# Altium schematic sheet 盟莆安方案.schdoc
size A4; Author: WJL; CompanyName: Wuxi China Resources Semico Co., Ltd.; ImagePath: F:\work group\公司信息\semico.bmp
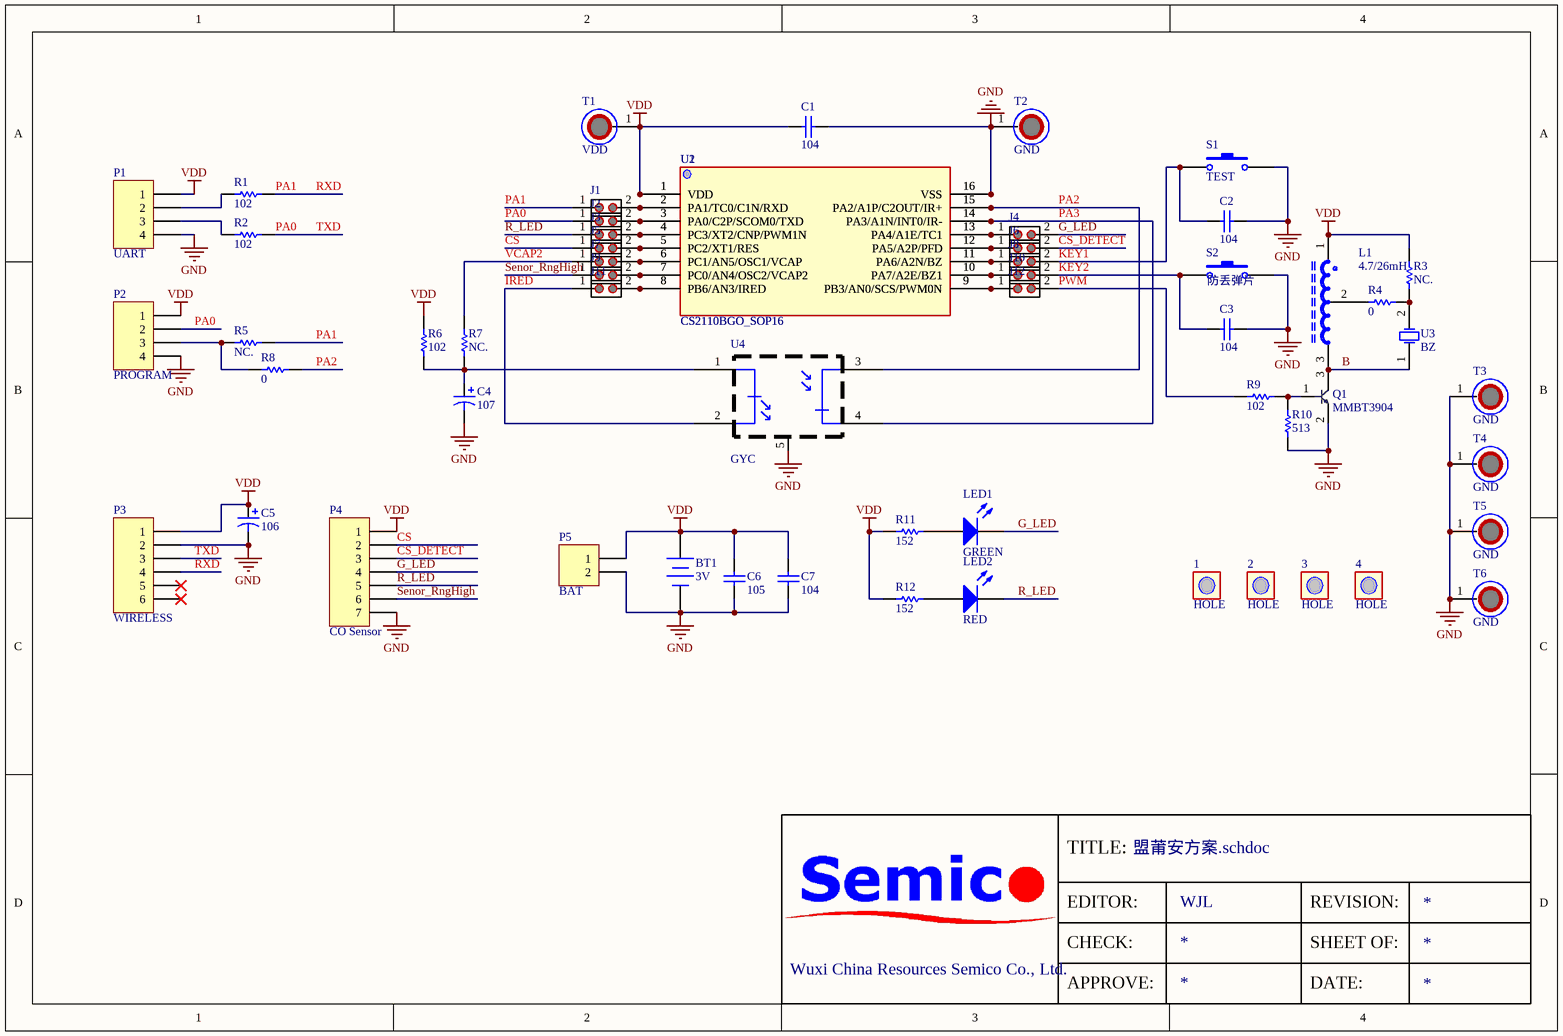
[diagram p0: 盟莆安方案.schdoc]

## Parts
1  HOLE  [HOLE]
2  HOLE  [HOLE]
3  HOLE  [HOLE]
4  HOLE  [HOLE]
BT1  3V  [BAT-2]
C1  104  [C0805]
C2  104  [C0805]
C3  104  [C0805]
C4  107  [220UF/16V]
C5  106  [47UF/25V]
C6  105  [C0805]
C7  104  [C0805]
J1  (no value)  [SIP2]
J2  (no value)  [SIP2]
J3  (no value)  [SIP2]
J4  (no value)  [SIP2]
J5  (no value)  [SIP2]
J6  (no value)  [SIP2]
J7  (no value)  [SIP2]
J8  (no value)  [SIP2]
J9  (no value)  [SIP2]
J10  (no value)  [SIP2]
J11  (no value)  [SIP2]
J12  (no value)  [SIP2]
L1  4.7/26mH  [LGB3W0912]
LED1  GREEN  [L0805]
LED2  RED  [L0805]
P1  UART  [HDR1X4]
P2  PROGRAM  [HDR1X4]
P3  WIRELESS  [HDR1X6]
P4  CO Sensor  [HDR1X7]
P5  BAT  [3.81-02P]
Q1  MMBT3904  [MMBT3906]
R1  102  [0805]
R2  102  [0805]
R3  NC.  [0805]
R4  0  [0805]
R5  NC.  [0805]
R6  102  [0805]
R7  NC.  [0805]
R8  0  [0805]
R9  102  [0805]
R10  513  [0805]
R11  152  [0805]
R12  152  [0805]
S1  TEST  [KEYP]
S2  (no value)  [KEYP]
T1  VDD  [TEST POINT]
T2  GND  [TEST POINT]
T3  GND  [TEST POINT]
T4  GND  [TEST POINT]
T5  GND  [TEST POINT]
T6  GND  [TEST POINT]
U1  CS2110BGO_SOP16  [SOP16]
U2  CS2110BGO_SOP16  [TSOP16底座]
U3  BZ  [SMD-BZ - 4]
U4  GYC  [YANCANG1]

## Nets
GND: BT1.2(-) C1.1 C2.2 C3.2 C4.2 C5.2 C6.2 C7.2 P1.4 P2.4 P3.2 P4.7 P5.2 Q1.2(E) R10.1 S1.2 S2.2 T2.1 T3.1 T4.1 T5.1 T6.1 U1.16(VSS) U2.16(VSS) U4.5(GND)
VDD: BT1.1(+) C1.2 C5.1 C6.1 C7.1 L1.1 P1.1 P2.1 P3.1 P4.1 P5.1 R3.1 R6.1 R11.2 R12.2 T1.1 U1.1(VDD) U2.1(VDD)
B: L1.3 Q1.3(C) U3.1(OSC1)
CS: J5.1 P4.2
CS_DETECT: J6.2 P4.3
G_LED: J4.2 LED1.2(K) P4.4
IRED: J11.1 U4.2
KEY1: C2.1 J8.2 S1.1
KEY2: C3.1 J10.2 S2.1
PA0: J2.1 P2.2 P3.3 R2.1  [also labelled TXD]
PA1: J1.1 P3.4 R1.1 R5.1  [also labelled RXD]
PA2: R8.1 U1.15(PA2/A1P/C2OUT/IR+) U2.15(PA2/A1P/C2OUT/IR+) U4.3
PA3: U1.14(PA3/A1N/INT0/IR-) U2.14(PA3/A1N/INT0/IR-) U4.4
PWM: J12.2 R9.2
R_LED: J3.1 LED2.2(K) P4.5
Senor_RngHigh: J9.1 P4.6
VCAP2: J7.1 R7.1
NetC4_1: C4.1 R6.2 R7.2 U4.1
NetJ1_2: J1.2 U1.2(PA1/TC0/C1N/RXD) U2.2(PA1/TC0/C1N/RXD)
NetJ2_2: J2.2 U1.3(PA0/C2P/SCOM0/TXD) U2.3(PA0/C2P/SCOM0/TXD)
NetJ3_2: J3.2 U1.4(PC3/XT2/CNP/PWM1N) U2.4(PC3/XT2/CNP/PWM1N)
NetJ4_1: J4.1 U1.13(PA4/A1E/TC1) U2.13(PA4/A1E/TC1)
NetJ5_2: J5.2 U1.5(PC2/XT1/RES) U2.5(PC2/XT1/RES)
NetJ6_1: J6.1 U1.12(PA5/A2P/PFD) U2.12(PA5/A2P/PFD)
NetJ7_2: J7.2 U1.6(PC1/AN5/OSC1/VCAP) U2.6(PC1/AN5/OSC1/VCAP)
NetJ8_1: J8.1 U1.11(PA6/A2N/BZ) U2.11(PA6/A2N/BZ)
NetJ9_2: J9.2 U1.7(PC0/AN4/OSC2/VCAP2) U2.7(PC0/AN4/OSC2/VCAP2)
NetJ10_1: J10.1 U1.10(PA7/A2E/BZ1) U2.10(PA7/A2E/BZ1)
NetJ11_2: J11.2 U1.8(PB6/AN3/IRED) U2.8(PB6/AN3/IRED)
NetJ12_1: J12.1 U1.9(PB3/AN0/SCS/PWM0N) U2.9(PB3/AN0/SCS/PWM0N)
NetL1_2: L1.2 R4.1
NetLED1_1: LED1.1(A) R11.1
NetLED2_1: LED2.1(A) R12.1
NetP1_2: P1.2 R1.2
NetP1_3: P1.3 R2.2
NetP2_3: P2.3 R5.2 R8.2
NetQ1_1: Q1.1(B) R9.1 R10.2
NetR3_2: R3.2 R4.2 U3.2(OSC2)

Not connected (* = marked no-connect by the designer): P3 5* 6*

## Notes on the sheet
- (near S2) 防丢弹片
- TITLE:
- EDITOR:
- REVISION:
- Wuxi China Resources Semico Co., Ltd.
- CHECK:
- APPROVE:
- DATE:
- SHEET OF:

## Library data of the parts
BT1 = Battery: Multicell Battery; Published: 24-Mar-1999; LatestRevisionDate: 17-Jul-2002; LatestRevisionNote: Re-released for DXP Platform.; PackageReference: BAT-2; Publisher: Altium Limited
C1-C3 C6 C7 = Cap: Capacitor; Value: 100pF; Published: 8-Jun-2000; LatestRevisionDate: 17-Jul-2002; LatestRevisionNote: Re-released for DXP Platform.; PackageReference: RAD-0.3; Publisher: Altium Limited
C4 C5 = Cap Pol1: Polarized Capacitor (Radial); Value: 100pF; Published: 8-Jun-2000; LatestRevisionDate: 17-Jul-2002; LatestRevisionNote: Re-released for DXP Platform.; PackageReference: RB7.6-15; Publisher: Altium Limited
J1-J12 = JUMPER(SIP2)
L1 = Inductor - 3
LED1 LED2 = LED0: Typical INFRARED GaAs LED; Published: 8-Jun-2000; LatestRevisionDate: 08-Jul-2005; LatestRevisionNote: Mech Layer 1 removed.; PackageReference: LED-0; Publisher: Altium Limited
P1 P2 = Header 4: Header, 4-Pin; LatestRevisionDate: 17-Jul-2002; LatestRevisionNote: Re-released for DXP Platform.; Publisher: Altium Limited
P3 = Header 6: Header, 6-Pin; LatestRevisionDate: 17-Jul-2002; LatestRevisionNote: Re-released for DXP Platform.; Publisher: Altium Limited
P4 = Header 7: Header, 7-Pin; LatestRevisionDate: 17-Jul-2002; LatestRevisionNote: Re-released for DXP Platform.; Publisher: Altium Limited
P5 = Header 2: Header, 2-Pin; LatestRevisionDate: 17-Jul-2002; LatestRevisionNote: Re-released for DXP Platform.; Publisher: Altium Limited
Q1 = NPN
R1-R12 = Res1: Resistor; Value: 1K; Published: 8-Jun-2000; LatestRevisionDate: 17-Jul-2002; LatestRevisionNote: Re-released for DXP Platform.; PackageReference: AXIAL-0.3; Publisher: Altium Limited
S1 S2 = SW-PB: Switch; Published: 24-Mar-1999; LatestRevisionDate: 17-Jul-2002; LatestRevisionNote: Re-released for DXP Platform.; PackageReference: SPST-2; Publisher: Altium Limited
T1-T6 = TEST POINT
U1 U2 = CS2110AGO_SOP16
U3 = XTAL: Crystal Oscillator; Published: 8-Jun-2000; LatestRevisionDate: 17-Jul-2002; LatestRevisionNote: Re-released for DXP Platform.; PackageReference: R38; Publisher: Altium Limited
U4 = 感烟仓